# Altium schematic sheet voltage_regulators.SchDoc
size A4; SheetNumber: 2; SheetTotal: 2
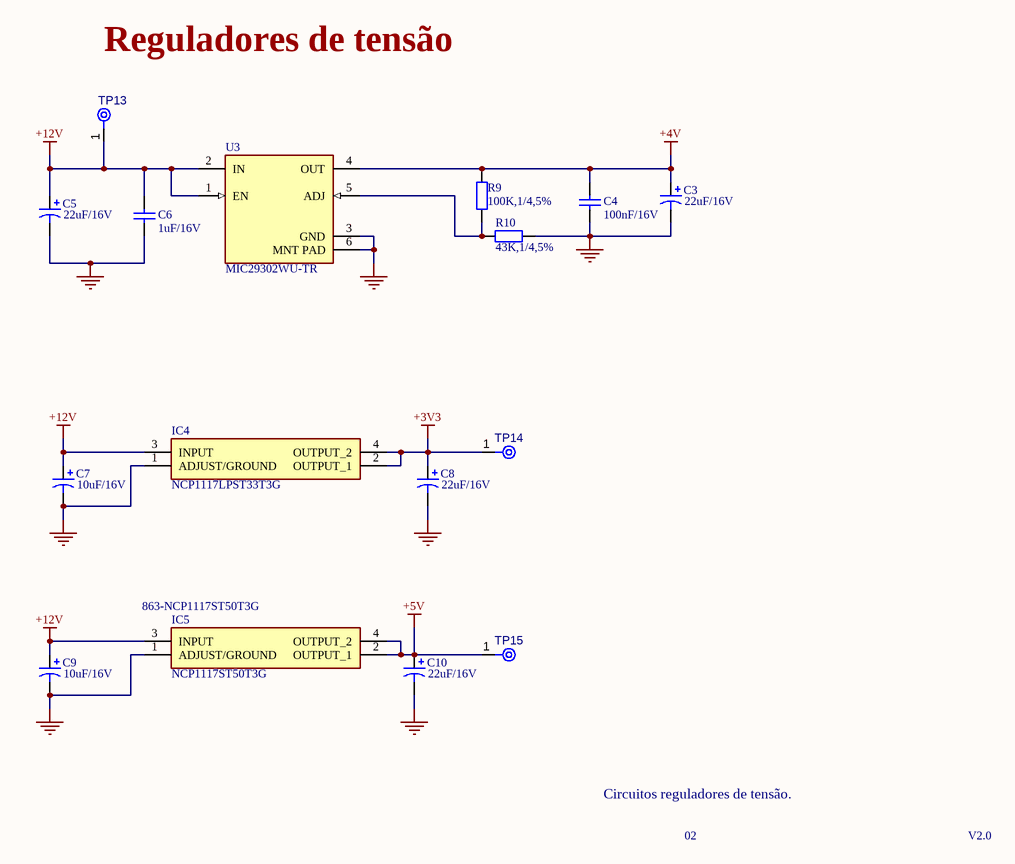
[diagram p0: voltage_regulators.SchDoc]

## Parts
C3  value 22uF/16V  [CAPPM3216X180N]  (hidden comment: Cap Pol3)
C4  value 100nF/16V  [C1206]  (hidden comment: Cap Semi)
C5  value 22uF/16V  [CAPPM3216X180N]  (hidden comment: Cap Pol3)
C6  value 1uF/16V  [C1206]  (hidden comment: Cap Semi)
C7  value 10uF/16V  [CAPPM3216X180N]  (hidden comment: Cap Pol3)
C8  value 22uF/16V  [CAPPM3216X180N]  (hidden comment: Cap Pol3)
C9  value 10uF/16V  [CAPPM3216X180N]  (hidden comment: Cap Pol3)
C10  value 22uF/16V  [CAPPM3216X180N]  (hidden comment: Cap Pol3)
IC4  NCP1117LPST33T3G  [SOT230P700X180-4N]
IC5  NCP1117ST50T3G  Supplier Part Number 2: 863-NCP1117ST50T3G  [SOT230P700X180-4N]
R9  value 100K,1/4,5%  [RESC3216X60N]  (hidden comment: Res2)
R10  value 43K,1/4,5%  [RESC3216X60N]  (hidden comment: Res2)
TP13  TPAD6R  [TP06R]  (value not drawn)  (no BOM)
TP14  TPAD6R  [TP06R]  (value not drawn)  (no BOM)
TP15  TPAD6R  [TP06R]  (value not drawn)  (no BOM)
U3  MIC29302WU-TR  [FP-C04-012-MFG]

## Nets
+3V3: C8.1 IC4.2(OUTPUT_1) IC4.4(OUTPUT_2) TP14.1(TP)
+4V: C3.1 C4.2 R9.2 U3.4(OUT)
+5V: C10.1 IC5.2(OUTPUT_1) IC5.4(OUTPUT_2) TP15.1(TP)
+12V: C5.1 C6.2 C7.1 C9.1 IC4.3(INPUT) IC5.3(INPUT) TP13.1(TP) U3.1(EN) U3.2(IN)
GND: C3.2 C4.1 C5.2 C6.1 C7.2 C8.2 C9.2 C10.2 IC4.1(ADJUST/GROUND) IC5.1(ADJUST/GROUND) R10.1 U3.3(GND) U3.6(MNT_PAD)
NetR9_1: R9.1 R10.2 U3.5(ADJ)

## Notes on the sheet
- Reguladores de tensão
- Circuitos reguladores de tensão.
- 02
- V2.0

## Library data of the parts
C3 C5 C8 C10 = Cap Pol3: Polarized Capacitor (Surface Mount); Manufacturer: KEMET; Manufacturer Part Number: TF08A226M016APE200; Published: 8-Jun-2000; LatestRevisionDate: 29-May-2009; LatestRevisionNote: IPC-7351 Footprint Added.; PackageReference: C0805; Publisher: Altium Limited; PackageDescription: Chip Capacitor; Supplier 1: Mouser; Supplier Part Number 1: 80-TF08A226M16APE200; RoHS: Yes; Stock 1: 1247; Pricing 1: 1=1.80000, 10=1.31000, 50=1.31000, 100=0.96000, 1000=0.65400, 10000=0.65400 (USD)
C4 = Cap Semi: Capacitor (Semiconductor SIM Model); Manufacturer: KEMET; Manufacturer Part Number: C1206X104G4HACTU; Published: 8-Jun-2000; LatestRevisionDate: 29-May-2009; LatestRevisionNote: IPC-7351 Footprint Added.; PackageReference: C1206; Publisher: Altium Limited; PackageDescription: Chip Capacitor; Supplier 1: Mouser; Supplier Part Number 1: 80-C1206X104G4HACTU; RoHS: Yes; Category: Capacitors; Stock 1: 2013; Pricing 1: 1=1.11000, 10=0.78000, 50=0.78000, 100=0.50000, 1000=0.39500, 10000=0.28500 (USD); RoHS Compliant: Yes
C6 = Cap Semi: CAP CER 1206 1UF 16V X7R 10%; Manufacturer: KEMET; Manufacturer Part Number: C1206C105K4REC7210; Published: 8-Jun-2000; LatestRevisionDate: 29-May-2009; LatestRevisionNote: IPC-7351 Footprint Added.; PackageReference: C1206; Publisher: Altium Limited; PackageDescription: Chip Capacitor; Supplier 1: Mouser; Supplier Part Number 1: 80-C1206C105K4RECLR; RoHS: Yes; Category: Ceramic Capacitors; Stock 1: 8446; Pricing 1: 1=0.34000, 10=0.20000, 50=0.20000, 100=0.12000, 1000=0.10300, 10000=0.07000 (USD); RoHS Compliant: Yes; ComponentLink1URL: https://api.kemet.com/component-edge/download/datasheet/C1206C105K4REC7210.pdf?src-supplier=Digi-Key; ComponentLink1Description: https://api.kemet.com/component-edge/download/datasheet/C1206C105K4REC7210.pdf?src-supplier=Digi-Key
C7 C9 = Cap Pol3: AVX - TCJA106M016R0200 - Tantalum Polymer Capacitor, 10 µF, 16 V, TCJ Series, ± 20%, A, 0.2 ohm; Manufacturer: Kyocera AVX; Capacitance: 10uF; ESR (Equivalent Series Resistance): 200mR; Voltage Rating: 16V; Leakage Current: 16uA; Polarity: Polar; Dissipation Factor: 6%; Published: 8-Jun-2000; LatestRevisionDate: 29-May-2009; LatestRevisionNote: IPC-7351 Footprint Added.; PackageReference: C0805; Publisher: Altium Limited; PackageDescription: Chip Capacitor; Supplier 1: Mouser; Supplier Part Number 1: 581-TCJA106M16R200; Manufacturer Part Number: TCJA106M016R0200; RoHS: Yes; Category: Tantalum Capacitors; Stock 1: 21788; Pricing 1: 1=0.71000, 10=0.52200, 50=0.52200, 100=0.35800, 1000=0.23800, 10000=0.18800 (USD); Mount: Surface Mount,PCB; Case/Package: 1206; Number of Pins: 2; Case Code (Imperial): 1206; Case Code (Metric): 3216; Dielectric Material: Tantalum; Min Operating Temperature: -55°C; Max Operating Temperature: 125°C; Tolerance: 20%; Packaging: Tape and Reel; Package Quantity: 1; Voltage Rating (DC): 16V; Termination: SMD/SMT; Voltage: 16V; Length: 3.2mm; Width: 1.6mm; Height: 1.6mm; Height - Seated (Max): 0.071inch; Depth: 1.6mm; Radiation Hardening: No; REACH SVHC: No SVHC; Lead Free: Lead Free; RoHS Compliant: Yes; ComponentLink1URL: https://datasheet.ciiva.com/11793/0900766b80eff593-11793323.pdf?src-supplier=RSComponents; ComponentLink1Description: https://datasheet.ciiva.com/11793/0900766b80eff593-11793323.pdf?src-supplier=RSComponents; ComponentLink2URL: https://datasheet.ciiva.com/22706/1805435-22706880.pdf?src-supplier=Element14; ComponentLink2Description: https://datasheet.ciiva.com/22706/1805435-22706880.pdf?src-supplier=Element14; ComponentLink3URL: https://datasheet.ciiva.com/264/tcj-264055.pdf?src-supplier=Digi-Key; ComponentLink3Description: https://datasheet.ciiva.com/264/tcj-264055.pdf?src-supplier=Digi-Key; ComponentLink4URL: https://datasheet.ciiva.com/264/tcj-264056.pdf?src-supplier=Digi-Key; ComponentLink4Description: https://datasheet.ciiva.com/264/tcj-264056.pdf?src-supplier=Digi-Key; ComponentLink5URL: https://datasheet.ciiva.com/264/tcj-264057.pdf?src-supplier=Digi-Key; ComponentLink5Description: https://datasheet.ciiva.com/264/tcj-264057.pdf?src-supplier=Digi-Key; ComponentLink6URL: https://datasheet.ciiva.com/11230/tcj-11230524.pdf?src-supplier=Avnet; ComponentLink6Description: https://datasheet.ciiva.com/11230/tcj-11230524.pdf?src-supplier=Avnet; ComponentLink7URL: https://datasheet.ciiva.com/16493/tcj-16493481.pdf?src-supplier=Future+Electronics; ComponentLink7Description: https://datasheet.ciiva.com/16493/tcj-16493481.pdf?src-supplier=Future+Electronics; ComponentLink8URL: https://datasheet.ciiva.com/14593/70001813-14593228.pdf?src-supplier=Allied+Electronics; ComponentLink8Description: https://datasheet.ciiva.com/14593/70001813-14593228.pdf?src-supplier=Allied+Electronics; ComponentLink9URL: https://datasheet.ciiva.com/7730/1805435-7730829.pdf?src-supplier=Element14; ComponentLink9Description: https://datasheet.ciiva.com/7730/1805435-7730829.pdf?src-supplier=Element14; ComponentLink10URL: https://datasheet.ciiva.com/7730/1805435-7730830.pdf?src-supplier=Element14; ComponentLink10Description: https://datasheet.ciiva.com/7730/1805435-7730830.pdf?src-supplier=Element14; ComponentLink11URL: https://datasheet.ciiva.com/7730/1805435-7730831.pdf?src-supplier=Element14; ComponentLink11Description: https://datasheet.ciiva.com/7730/1805435-7730831.pdf?src-supplier=Element14; ComponentLink12URL: https://datasheet.ciiva.com/14596/70001813-14596970.pdf?src-supplier=Allied+Electronics; ComponentLink12Description: https://datasheet.ciiva.com/14596/70001813-14596970.pdf?src-supplier=Allied+Electronics
IC4 = NCP1117ST33T3G: ON SEMICONDUCTOR - NCP1117LPST33T3G - Fixed LDO Voltage Regulator, 18V in, 1.3V Dropout, 3.3V/1A out, SOT-223-3; Number of Outputs: 1; Min Input Voltage: -300mV; Output Voltage: 3.3V; Max Output Current: 1A; Min Current Limit: 1.1A; Quiescent Current: 700uA; Reference Voltage: 1.275V; Polarity: Positive; Power Supply Rejection Ratio (PSRR): 60dB; Supplier 1: Mouser; Supplier Part Number 1: 863-NCP1117LPST33T3G; Manufacturer: ON Semiconductor; Manufacturer Part Number: NCP1117LPST33T3G; RoHS: Yes; Category: Voltage Regulators - Linear; Stock 1: 1680; Pricing 1: 1=0.49000, 10=0.36000, 50=0.36000, 100=0.24300, 1000=0.15100, 10000=0.12100 (USD); Mount: Surface Mount; Case/Package: SOT-223; Number of Pins: 3; Contact Plating: Tin,Matte; Min Operating Temperature: 0°C; Max Operating Temperature: 125°C; Dropout Voltage: 1.3V; Packaging: Tape and Reel; Package Quantity: 1; Max Input Voltage: 18V; Output Current: 1A; Number of Regulators: 1; Min Output Voltage: 3.3V; Nominal Output Voltage: 3.3V; Output Type: Fixed; Series: -; Length: 6.7mm; Width: 3.7mm; Height: 1.69mm; REACH SVHC: No SVHC; Lead Free: Lead Free; Halogen Free: Halogen Free; RoHS Compliant: Yes; ComponentLink1URL: https://datasheet.ciiva.com/8231/ncp1117lp-d-8231034.pdf?src-supplier=Avnet; ComponentLink1Description: https://datasheet.ciiva.com/8231/ncp1117lp-d-8231034.pdf?src-supplier=Avnet; ComponentLink2URL: https://datasheet.ciiva.com/8233/ncp1117lp-d-8233561.pdf?src-supplier=Avnet; ComponentLink2Description: https://datasheet.ciiva.com/8233/ncp1117lp-d-8233561.pdf?src-supplier=Avnet; ComponentLink3URL: https://datasheet.ciiva.com/6590/ncp1117lp-d-6590870.pdf?src-supplier=Digi-Key; ComponentLink3Description: https://datasheet.ciiva.com/6590/ncp1117lp-d-6590870.pdf?src-supplier=Digi-Key; ComponentLink4URL: https://datasheet.ciiva.com/6590/ncp1117lp-d-6590872.pdf?src-supplier=Digi-Key; ComponentLink4Description: https://datasheet.ciiva.com/6590/ncp1117lp-d-6590872.pdf?src-supplier=Digi-Key; ComponentLink5URL: https://datasheet.ciiva.com/6590/ncp1117lp-d-6590873.pdf?src-supplier=Digi-Key; ComponentLink5Description: https://datasheet.ciiva.com/6590/ncp1117lp-d-6590873.pdf?src-supplier=Digi-Key; ComponentLink6URL: https://datasheet.ciiva.com/4887/ncp1117lp-d-82673-4887580.pdf?src-supplier=Mouser; ComponentLink6Description: https://datasheet.ciiva.com/4887/ncp1117lp-d-82673-4887580.pdf?src-supplier=Mouser; ComponentLink7URL: https://datasheet.ciiva.com/16468/ncp1117lp-d-16468566.pdf?src-supplier=Future+Electronics; ComponentLink7Description: https://datasheet.ciiva.com/16468/ncp1117lp-d-16468566.pdf?src-supplier=Future+Electronics
IC5 = NCP1117ST50T3G: ON SEMICONDUCTOR - NCP1117ST50T3G - Fixed LDO Voltage Regulator, 3.5V to 20V, 1.07V Dropout, 5Vout, 1Aout, SOT-223-3; Manufacturer Part Number: NCP1117ST33T3G; Output Voltage: 3.3V; Number of Outputs: 1; Output Current: 1A; Max Supply Voltage: 15V; Min Supply Voltage: 4.75V; Input Bias Current: 6mA; Quiescent Current: 10mA; Polarity: Positive; Reference Voltage: 1.25V; Accuracy: 1%; Power Rating: 781mW; Datasheet Link: http://www.onsemi.com/pub/Collateral/NCP1117-D.PDF; Height: 1.8mm; Manufacturer_Name: ON Semiconductor; Manufacturer_Part_Number: NCP1117ST50T3G; Mouser Part Number: 863-NCP1117ST50T3G; Mouser Price/Stock: https://www.mouser.co.uk/ProductDetail/ON-Semiconductor/NCP1117ST50T3G/?qs=Gev%252BmEvV0ib6dijy6U0dhQ%3D%3D; Arrow Part Number: NCP1117ST50T3G; Arrow Price/Stock: https://www.arrow.com/en/products/ncp1117st50t3g/on-semiconductor; Supplier 1: Mouser; Supplier Part Number 1: 863-NCP1117ST33T3G; Manufacturer: ON Semiconductor; RoHS: Yes; Category: Voltage Regulators - Linear; Pricing 1: 1=0.56000, 10=0.47900, 50=0.47900, 100=0.33200, 1000=0.21700, 10000=0.17400 (USD); Mount: Surface Mount; Case/Package: SOT-223; Number of Pins: 3; Contact Plating: Tin,Matte; Min Operating Temperature: 0°C; Max Operating Temperature: 125°C; Max Input Voltage: 20V; Packaging: Tape and Reel; Dropout Voltage: 1.07V; Max Output Current: 1A; Package Quantity: 1; Min Input Voltage: 3.5V; Nominal Output Voltage: 3.3V; Number of Regulators: 1; Min Current Limit: 1A; Min Output Voltage: 3.3V; Max Output Voltage: 3.3V; Termination: SMD/SMT; Output Voltage Accuracy: 1%; Output Type: Fixed; Length: 6.7mm; Width: 3.7mm; Radiation Hardening: No; REACH SVHC: No SVHC; Lead Free: Lead Free; Halogen Free: Halogen Free; RoHS Compliant: Yes; ComponentLink1URL: https://datasheet.ciiva.com/3224/ncp1117-d-3224144.pdf?src-supplier=Avnet; ComponentLink1Description: https://datasheet.ciiva.com/3224/ncp1117-d-3224144.pdf?src-supplier=Avnet; ComponentLink2URL: https://datasheet.ciiva.com/15111/getdatasheetpartid-82718-15111483.pdf?src-supplier=Verical; ComponentLink2Description: https://datasheet.ciiva.com/15111/getdatasheetpartid-82718-15111483.pdf?src-supplier=Verical; ComponentLink3URL: https://datasheet.ciiva.com/22697/1726422-22697602.pdf?src-supplier=Element14; ComponentLink3Description: https://datasheet.ciiva.com/22697/1726422-22697602.pdf?src-supplier=Element14; ComponentLink4URL: https://datasheet.ciiva.com/2042/ncp1117-d-2042027.pdf?src-supplier=Digi-Key; ComponentLink4Description: https://datasheet.ciiva.com/2042/ncp1117-d-2042027.pdf?src-supplier=Digi-Key; ComponentLink5URL: https://datasheet.ciiva.com/2042/ncp1117-d-2042028.pdf?src-supplier=Digi-Key; ComponentLink5Description: https://datasheet.ciiva.com/2042/ncp1117-d-2042028.pdf?src-supplier=Digi-Key; ComponentLink6URL: https://datasheet.ciiva.com/2042/ncp1117-d-2042029.pdf?src-supplier=Digi-Key; ComponentLink6Description: https://datasheet.ciiva.com/2042/ncp1117-d-2042029.pdf?src-supplier=Digi-Key; ComponentLink7URL: https://datasheet.ciiva.com/8233/ncp1117-d-8233589.pdf?src-supplier=Avnet; ComponentLink7Description: https://datasheet.ciiva.com/8233/ncp1117-d-8233589.pdf?src-supplier=Avnet; ComponentLink8URL: https://datasheet.ciiva.com/8073/1726422-8073735.pdf?src-supplier=Element14; ComponentLink8Description: https://datasheet.ciiva.com/8073/1726422-8073735.pdf?src-supplier=Element14; ComponentLink9URL: https://datasheet.ciiva.com/28483/1748260-28483307.pdf?src-supplier=Element14; ComponentLink9Description: https://datasheet.ciiva.com/28483/1748260-28483307.pdf?src-supplier=Element14; ComponentLink10URL: https://datasheet.ciiva.com/16382/ncp1117-d-16382636.pdf?src-supplier=Future+Electronics; ComponentLink10Description: https://datasheet.ciiva.com/16382/ncp1117-d-16382636.pdf?src-supplier=Future+Electronics; Supplier 2: Mouser; Stock 2: 142; Pricing 2: 1=0.48000, 10=0.38400, 50=0.38400, 100=0.28500, 1000=0.18700, 10000=0.15200 (USD); Tolerance: 1%; ComponentLink11URL: https://datasheet.ciiva.com/28483/1748260-28483320.pdf?src-supplier=Element14; ComponentLink11Description: https://datasheet.ciiva.com/28483/1748260-28483320.pdf?src-supplier=Element14; ComponentLink12URL: https://datasheet.ciiva.com/2042/ncp1117-d-2042018.pdf?src-supplier=Digi-Key; ComponentLink12Description: https://datasheet.ciiva.com/2042/ncp1117-d-2042018.pdf?src-supplier=Digi-Key; ComponentLink13URL: https://datasheet.ciiva.com/2042/ncp1117-d-2042019.pdf?src-supplier=Digi-Key; ComponentLink13Description: https://datasheet.ciiva.com/2042/ncp1117-d-2042019.pdf?src-supplier=Digi-Key; ComponentLink14URL: https://datasheet.ciiva.com/2042/ncp1117-d-2042020.pdf?src-supplier=Digi-Key; ComponentLink14Description: https://datasheet.ciiva.com/2042/ncp1117-d-2042020.pdf?src-supplier=Digi-Key; ComponentLink15URL: https://datasheet.ciiva.com/8231/ncp1117-d-8231068.pdf?src-supplier=Avnet; ComponentLink15Description: https://datasheet.ciiva.com/8231/ncp1117-d-8231068.pdf?src-supplier=Avnet; ComponentLink16URL: https://datasheet.ciiva.com/8233/ncp1117-d-8233593.pdf?src-supplier=Avnet; ComponentLink16Description: https://datasheet.ciiva.com/8233/ncp1117-d-8233593.pdf?src-supplier=Avnet; ComponentLink17URL: https://datasheet.ciiva.com/16491/ncp1117-d-16491895.pdf?src-supplier=Avnet+Asia; ComponentLink17Description: https://datasheet.ciiva.com/16491/ncp1117-d-16491895.pdf?src-supplier=Avnet+Asia; ComponentLink18URL: https://datasheet.ciiva.com/16209/ncp1117-d-16209561.pdf?src-supplier=Future+Electronics; ComponentLink18Description: https://datasheet.ciiva.com/16209/ncp1117-d-16209561.pdf?src-supplier=Future+Electronics; ComponentLink19URL: https://datasheet.ciiva.com/8073/ncp1117-d-8073736.pdf?src-supplier=Element14; ComponentLink19Description: https://datasheet.ciiva.com/8073/ncp1117-d-8073736.pdf?src-supplier=Element14; ComponentLink20URL: https://datasheet.ciiva.com/8073/ncp1117-d-8073902.pdf?src-supplier=Element14; ComponentLink20Description: https://datasheet.ciiva.com/8073/ncp1117-d-8073902.pdf?src-supplier=Element14; ComponentLink21URL: https://datasheet.ciiva.com/25978/ncp1117-d-25978293.pdf?src-supplier=Avnet+Europe; ComponentLink21Description: https://datasheet.ciiva.com/25978/ncp1117-d-25978293.pdf?src-supplier=Avnet+Europe
R9 = Res2: RES SMD 100K OHM 5% 1/4W 1206; Manufacturer: Vishay Dale; Manufacturer Part Number: CRCW1206100KJNEA; Resistance: 100kR; Temperature Coefficient: 200ppm/°C; Power Rating: 250mW; Voltage Rating: 200V; Published: 8-Jun-2000; LatestRevisionDate: 17-Jul-2002; LatestRevisionNote: Re-released for DXP Platform.; PackageReference: AXIAL-0.4; Publisher: Altium Limited; PackageDescription: Axial Device, Thru-Hole; 2 Leads; 0.4 in Pin Spacing; Supplier 1: Mouser; Supplier Part Number 1: 71-CRCW1206J-100K-E3; RoHS: Yes; Category: Chip SMD Resistors; Stock 1: 17942; Pricing 1: 1=0.10000, 10=0.06600, 50=0.06600, 100=0.02700, 1000=0.01100, 10000=0.01100 (USD); Mount: Surface Mount; Case/Package: 1206; Number of Pins: 2; Case Code (Metric): 3216; Case Code (Imperial): 1206; Contact Plating: Tin; Weight: 0.000353oz; Size Code: 1206; Min Operating Temperature: -55°C; Max Operating Temperature: 155°C; Tolerance: 5%; Resistor Type: Thick Film; Packaging: Tape and Reel; Number of Terminations: 2; Max Power Dissipation: 250mW; Features: Automotive AEC-Q200; Series: CRCW; Package Quantity: 1; Termination: SMD/SMT; Voltage Rating (DC): 200V; Resistance Tolerance: 5%; Construction: Rectangular; Length: 3.2mm; Width: 0.063inch; Height: 0.024inch; Depth: 1.6mm; Radiation Hardening: No; Lead Free: Lead Free; RoHS Compliant: Yes; REACH SVHC: Unknown; Military Standard: Not; ComponentLink1URL: https://datasheet.ciiva.com/7107/1747939-7107664.pdf?src-supplier=Newark; ComponentLink1Description: https://datasheet.ciiva.com/7107/1747939-7107664.pdf?src-supplier=Newark; ComponentLink2URL: https://datasheet.ciiva.com/2468/dcrcwe3-2468223.pdf?src-supplier=Digi-Key; ComponentLink2Description: https://datasheet.ciiva.com/2468/dcrcwe3-2468223.pdf?src-supplier=Digi-Key; ComponentLink3URL: https://datasheet.ciiva.com/2468/dcrcwe3-2468224.pdf?src-supplier=Digi-Key; ComponentLink3Description: https://datasheet.ciiva.com/2468/dcrcwe3-2468224.pdf?src-supplier=Digi-Key; ComponentLink4URL: https://datasheet.ciiva.com/2468/dcrcwe3-2468225.pdf?src-supplier=Digi-Key; ComponentLink4Description: https://datasheet.ciiva.com/2468/dcrcwe3-2468225.pdf?src-supplier=Digi-Key; ComponentLink5URL: https://datasheet.ciiva.com/5548/dcrcwe3-109170-5548556.pdf?src-supplier=Mouser; ComponentLink5Description: https://datasheet.ciiva.com/5548/dcrcwe3-109170-5548556.pdf?src-supplier=Mouser; ComponentLink6URL: https://datasheet.ciiva.com/28621/1747939-28621479.pdf?src-supplier=Element14; ComponentLink6Description: https://datasheet.ciiva.com/28621/1747939-28621479.pdf?src-supplier=Element14; ComponentLink7URL: https://datasheet.ciiva.com/8979/dcrcwe3-8979863.pdf?src-supplier=Avnet; ComponentLink7Description: https://datasheet.ciiva.com/8979/dcrcwe3-8979863.pdf?src-supplier=Avnet; ComponentLink8URL: https://datasheet.ciiva.com/8979/dcrcwe3-8979869.pdf?src-supplier=Avnet; ComponentLink8Description: https://datasheet.ciiva.com/8979/dcrcwe3-8979869.pdf?src-supplier=Avnet; ComponentLink9URL: https://datasheet.ciiva.com/15159/getdatasheetpartid-45729-15159543.pdf?src-supplier=Verical; ComponentLink9Description: https://datasheet.ciiva.com/15159/getdatasheetpartid-45729-15159543.pdf?src-supplier=Verical; ComponentLink10URL: https://datasheet.ciiva.com/16755/70201119-16755608.pdf?src-supplier=Allied+Electronics; ComponentLink10Description: https://datasheet.ciiva.com/16755/70201119-16755608.pdf?src-supplier=Allied+Electronics; ComponentLink11URL: https://datasheet.ciiva.com/16765/70201119-16765961.pdf?src-supplier=Allied+Electronics; ComponentLink11Description: https://datasheet.ciiva.com/16765/70201119-16765961.pdf?src-supplier=Allied+Electronics
R10 = Res2: RES SMD 43K OHM 5% 1/4W 1206; Manufacturer: Vishay Dale; Manufacturer Part Number: CRCW120643K0JNEA; Resistance: 43kR; Max Power Dissipation: 250mW; Temperature Coefficient: 200ppm/°C; Voltage Rating: 200V; Published: 8-Jun-2000; LatestRevisionDate: 17-Jul-2002; LatestRevisionNote: Re-released for DXP Platform.; PackageReference: AXIAL-0.4; Publisher: Altium Limited; PackageDescription: Axial Device, Thru-Hole; 2 Leads; 0.4 in Pin Spacing; Supplier 1: Mouser; Supplier Part Number 1: 71-CRCW1206J-43K-E3; RoHS: Yes; Category: Chip SMD Resistors; Stock 1: 26455; Pricing 1: 1=0.10000, 10=0.07200, 50=0.07200, 100=0.03200, 1000=0.01600, 10000=0.00800 (USD); Case/Package: 1206; Case Code (Metric): 3216; Case Code (Imperial): 1206; Contact Plating: Tin; Weight: 0.000353oz; Min Operating Temperature: -55°C; Max Operating Temperature: 155°C; Tolerance: 5%; Packaging: Tape and Reel; Package Quantity: 1; Resistor Type: Thick Film; Number of Terminations: 2; Features: Automotive AEC-Q200; Series: CRCW; Power Rating: 250mW; Termination: SMD/SMT; Voltage Rating (DC): 200V; Construction: Rectangular; Length: 3.2mm; Width: 0.063inch; Height: 0.024inch; Depth: 1.6mm; Lead Free: Lead Free; RoHS Compliant: Yes; Military Standard: Not; ComponentLink1URL: https://datasheet.ciiva.com/5542/dcrcwe3-109170-5542254.pdf?src-supplier=Mouser; ComponentLink1Description: https://datasheet.ciiva.com/5542/dcrcwe3-109170-5542254.pdf?src-supplier=Mouser; ComponentLink2URL: https://datasheet.ciiva.com/9008/dcrcwe3-9008908.pdf?src-supplier=Avnet; ComponentLink2Description: https://datasheet.ciiva.com/9008/dcrcwe3-9008908.pdf?src-supplier=Avnet; ComponentLink3URL: https://datasheet.ciiva.com/2496/dcrcwe3-2496505.pdf?src-supplier=Digi-Key; ComponentLink3Description: https://datasheet.ciiva.com/2496/dcrcwe3-2496505.pdf?src-supplier=Digi-Key; ComponentLink4URL: https://datasheet.ciiva.com/2496/dcrcwe3-2496506.pdf?src-supplier=Digi-Key; ComponentLink4Description: https://datasheet.ciiva.com/2496/dcrcwe3-2496506.pdf?src-supplier=Digi-Key; ComponentLink5URL: https://datasheet.ciiva.com/2496/dcrcwe3-2496507.pdf?src-supplier=Digi-Key; ComponentLink5Description: https://datasheet.ciiva.com/2496/dcrcwe3-2496507.pdf?src-supplier=Digi-Key
TP13-TP15 = CMP-00028-00002-2: 0.6mm round; Pins: 1
U3 = CMP-06324-000007-1: IC REG LINEAR POS ADJ 3A TO263-5; Manufacturer: Microchip; Output Voltage: 3.3-12V; Output Type: AdjustableProgrammable; Max Junction Temp: +125°C; Standoff Height: 0mm; Accuracy Percentage: 1%; Max Supply Voltage: 26V; Nominal Supply Current: 10-37mA; Number Of Outputs: 1; Dropout Voltage: 370mV; Min Supply Voltage: 2.25V; ComponentLink2URL: http://ww1.microchip.com/downloads/en/DeviceDoc/MIC2915x-30x-50x-75x-High-Current-Low-Dropout-Regulators-DS20005685B.pdf; Device Class L1: Integrated Circuits (ICs); Digikey Description: IC REG LINEAR POS ADJ 3A TO263-5; Device Class L2: Power Management ICs; Lead Free: Yes; Mouser Description: LDO Voltage Regulators; Package: C04-012; Temperature: -40°C to +125°C; ComponentLink2Description: Datasheet; Temperature Range High: +125°C; Automotive: No; Device Class L3: Voltage Regulators - Linear; Category: IC; Temperature Range Low: -40°C; RoHS: TRUE; Output Current: 3A; Octopart: https://octopart.com/mic29302wu-tr-microchip-66801318; Manufacturer Part Number: MIC29302WU-TR; Height: 0.2inch